# Altium schematic sheet 18 USB2_USB3.SchDoc: CM4 IO
size 297 x 209 mm; Page Create Date: March  8, 1995; Page Number: 18; Page Size: A4; Comment: radxa_1010; Page Count: 19; RevCode: V1.10; Doc: 18 USB2/USB3; DsnPath: D:\WMS\黄工\[RC126]CM4_IO_V1.10\[RC126]_V1.10\CM4 IO_V1.10.DSN; SchematicName: CM4 IO V1.10; PageName: 18 USB2/USB3; PageSize: A4; TopSchematic: True
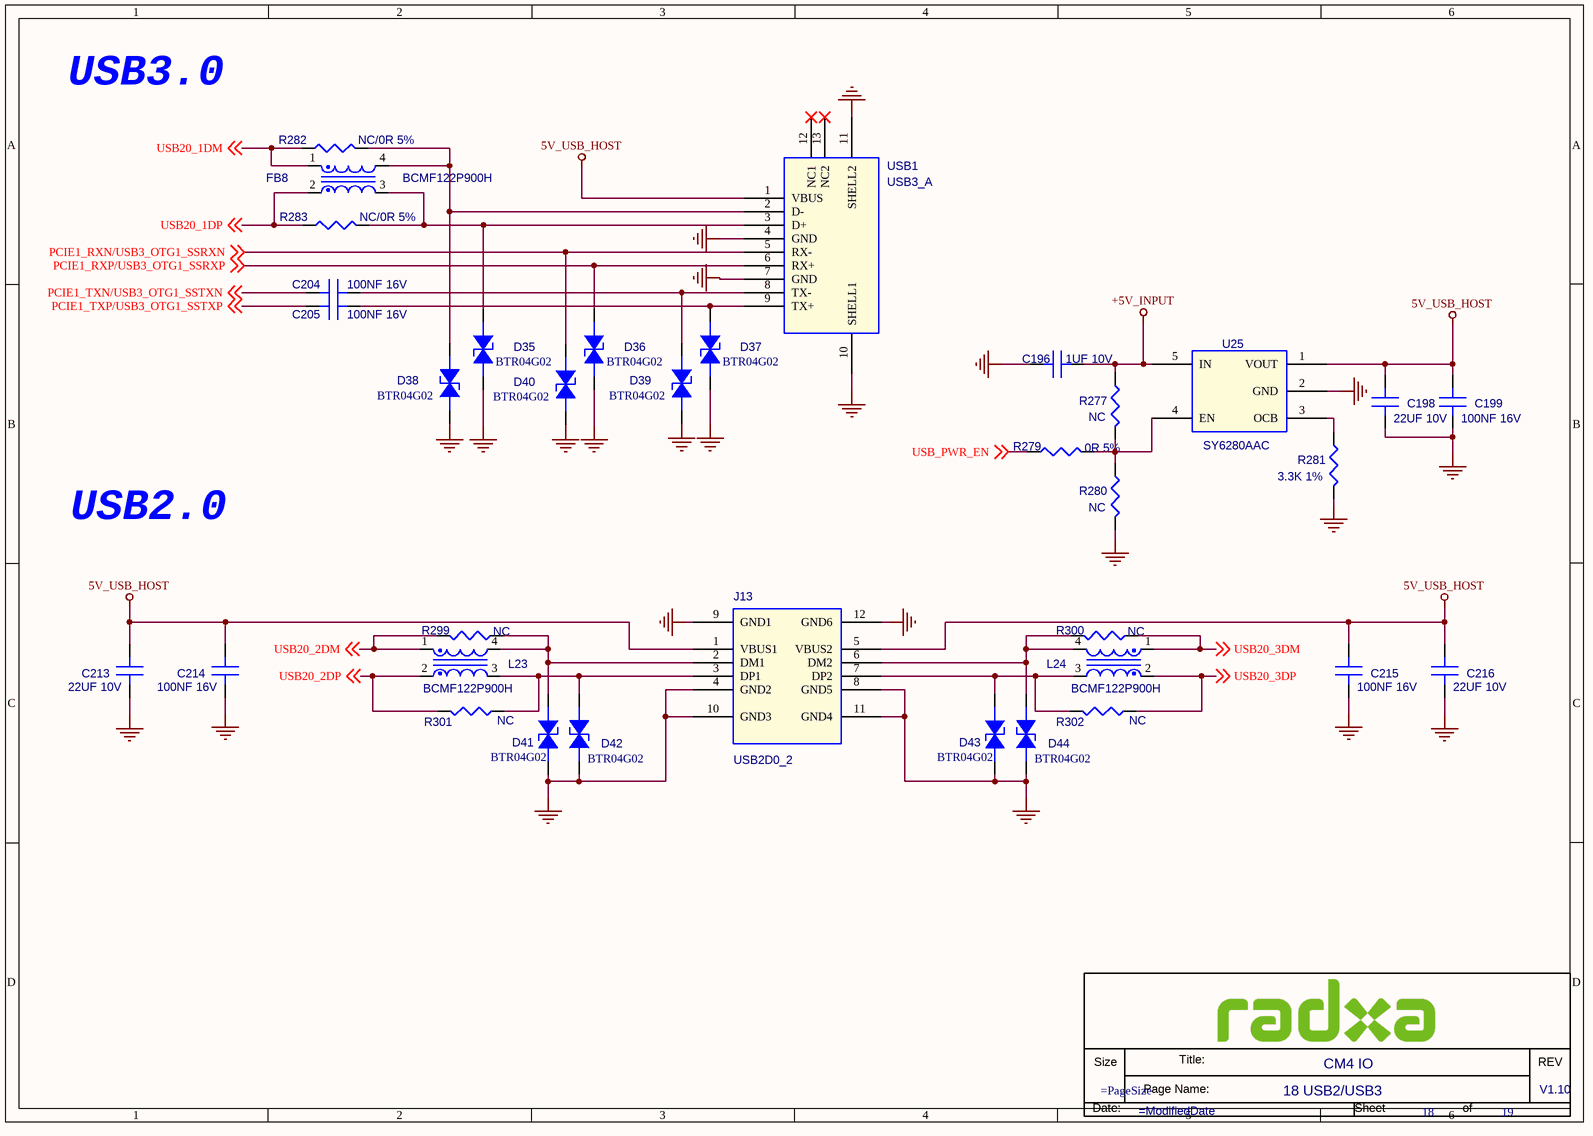
[diagram p0: 18 USB2_USB3.SchDoc]

## Parts
*  Doc: 18 USB2/USB3  RevCode: V1.10  Title: CM4 IO  Page Number: 18  Page Count: 19  (hidden comment: radxa_1010)  (graphical)
C196  1UF 10V  [C0201]
C198  22UF 10V  [C0603]
C199  100NF 16V  [C0201]
C204  100NF 16V  [C0201]
C205  100NF 16V  [C0201]
C213  22UF 10V  [C0603]
C214  100NF 16V  [C0201]
C215  100NF 16V  [C0201]
C216  22UF 10V  [C0603]
D35  BTR04G02  [DFN1006-2L]
D36  BTR04G02  [DFN1006-2L]
D37  BTR04G02  [DFN1006-2L]
D38  BTR04G02  [DFN1006-2L]
D39  BTR04G02  [DFN1006-2L]
D40  BTR04G02  [DFN1006-2L]
D41  BTR04G02  [DFN1006-2L]
D42  BTR04G02  [DFN1006-2L]
D43  BTR04G02  [DFN1006-2L]
D44  BTR04G02  [DFN1006-2L]
FB8  BCMF122P900H  [LC1210]
J13  USB2D0_2  [CON_USB2D0_TH1X2_LIE]
L23  BCMF122P900H  [LC1210]
L24  BCMF122P900H  [LC1210]
R277  NC  [R0402]
R279  0R 5%  [R0402]
R280  NC  [R0402]
R281  3.3K 1%  [R0402]
R282  NC/0R 5%  [R0402]
R283  NC/0R 5%  [R0402]
R299  NC  [R0402]
R300  NC  [R0402]
R301  NC  [R0402]
R302  NC  [R0402]
U25  SY6280AAC  [SOT23_5]
USB1  USB3_A  [USB_SM9_2D0_LIE]

## Nets
5V_USB_HOST: C198.1(A) C199.1(A) C213.1(A) C214.1(A) C215.1(A) C216.1(A) J13.1(VBUS1) J13.5(VBUS2) U25.1(VOUT) USB1.1(VBUS)
+5V_INPUT: C196.1(A) R277.1 U25.5(IN)
GND: C196.2(B) C198.2(B) C199.2(B) C213.2(B) C214.2(B) C215.2(B) C216.2(B) D35.1(ANODE) D36.1(ANODE) D37.1(ANODE) D38.1(ANODE) D39.1(ANODE) D40.1(ANODE) D41.1(ANODE) D42.1(ANODE) D43.1(ANODE) D44.1(ANODE) J13.4(GND2) J13.8(GND5) J13.9(GND1) J13.10(GND3) J13.11(GND4) J13.12(GND6) R280.2 R281.2 U25.2(GND) USB1.4(GND) USB1.7(GND) USB1.10(SHELL1) USB1.11(SHELL2)
PCIE1_RXN/USB3_OTG1_SSRXN: D40.2(CATHODE) USB1.5(RX-) ; off-sheet PCIE1_RXN/USB3_OTG1_SSRXN
PCIE1_RXP/USB3_OTG1_SSRXP: D36.2(CATHODE) USB1.6(RX+) ; off-sheet PCIE1_RXP/USB3_OTG1_SSRXP
PCIE1_TXN/USB3_OTG1_SSTXN: C204.1(A) ; off-sheet PCIE1_TXN/USB3_OTG1_SSTXN
PCIE1_TXP/USB3_OTG1_SSTXP: C205.1(A) ; off-sheet PCIE1_TXP/USB3_OTG1_SSTXP
USB20_1DM: FB8.1 R282.2 ; off-sheet USB20_1DM
USB20_1DP: FB8.2 R283.2 ; off-sheet USB20_1DP
USB20_2DM: L23.1 R299.1 ; off-sheet USB20_2DM
USB20_2DP: L23.2 R301.1 ; off-sheet USB20_2DP
USB20_3DM: L24.1 R300.1 ; off-sheet USB20_3DM
USB20_3DP: L24.2 R302.1 ; off-sheet USB20_3DP
USB_PWR_EN: R279.2 ; off-sheet USB_PWR_EN
NetC204_2: C204.2(B) D39.2(CATHODE) USB1.8(TX-)
NetC205_2: C205.2(B) D37.2(CATHODE) USB1.9(TX+)
NetD35_2: D35.2(CATHODE) FB8.3 R283.1 USB1.3(D+)
NetD38_2: D38.2(CATHODE) FB8.4 R282.1 USB1.2(D-)
NetD41_2: D41.2(CATHODE) J13.2(DM1) L23.4 R299.2
NetD42_2: D42.2(CATHODE) J13.3(DP1) L23.3 R301.2
NetD43_2: D43.2(CATHODE) J13.7(DP2) L24.3 R302.2
NetD44_2: D44.2(CATHODE) J13.6(DM2) L24.4 R300.2
NetR277_2: R277.2 R279.1 R280.1 U25.4(EN)
NetR281_1: R281.1 U25.3(OCB)

Not connected (* = marked no-connect by the designer): USB1 12(NC1)* 13(NC2)*

## Notes on the sheet
- USB3.0
- USB2.0
- (in symbol radxa_1010) Size; Title:; REV; Page Name:; Date:; Sheet; of

## Library data of the parts
C196 = C: SMD  0201  1UF  10V  X5R  ±20%  ROHS; PARTS: 1; Part Reference: C196; Part Number: A1C01.00081; OriginalSymbolOrigin: (0,30); PKG_TYPE: CAP2-100-250; LEVEL: STD; PINSWAP: (A,B); Value: 1UF 10V; Part Type: 陶瓷电容; PCB Footprint: C0201
C198 = C: SMD  0603  22UF  10V  X5R  ±20%  ROHS; PARTS: 1; Part Reference: C198; Part Number: A1C01.00015; OriginalSymbolOrigin: (0,30); PKG_TYPE: CAP2-100-250; LEVEL: STD; PINSWAP: (A,B); Value: 22UF 10V; Part Type: 陶瓷电容; PCB Footprint: C0603
C199 = C: SMD  0201  100NF  16V  X5R  ±20%  ROHS; PARTS: 1; Part Reference: C199; Part Number: A1C01.00099; OriginalSymbolOrigin: (0,30); PKG_TYPE: CAP2-100-250; LEVEL: STD; PINSWAP: (A,B); Preferred: 6715f349cd0bc5; Value: 100NF 16V; Part Type: 陶瓷电容
C204 = C: SMD  0201  100NF  16V  X5R  ±20%  ROHS; PARTS: 1; Part Reference: C204; Part Number: A1C01.00099; OriginalSymbolOrigin: (0,30); PKG_TYPE: CAP2-100-250; LEVEL: STD; PINSWAP: (A,B); Preferred: 6715f349cd0bc5; Value: 100NF 16V; Part Type: 陶瓷电容
C205 = C: SMD  0201  100NF  16V  X5R  ±20%  ROHS; PARTS: 1; Part Reference: C205; Part Number: A1C01.00099; OriginalSymbolOrigin: (0,30); PKG_TYPE: CAP2-100-250; LEVEL: STD; PINSWAP: (A,B); Preferred: 6715f349cd0bc5; Value: 100NF 16V; Part Type: 陶瓷电容
C213 = C: SMD  0603  22UF  10V  X5R  ±20%  ROHS; PARTS: 1; Part Reference: C213; Part Number: A1C01.00015; OriginalSymbolOrigin: (0,30); PKG_TYPE: CAP2-100-250; LEVEL: STD; PINSWAP: (A,B); Value: 22UF 10V; Part Type: 陶瓷电容; PCB Footprint: C0603
C214 = C: SMD  0201  100NF  16V  X5R  ±20%  ROHS; PARTS: 1; Part Reference: C214; Part Number: A1C01.00099; OriginalSymbolOrigin: (0,30); PKG_TYPE: CAP2-100-250; LEVEL: STD; PINSWAP: (A,B); Preferred: 6715f349cd0bc5; Value: 100NF 16V; Part Type: 陶瓷电容
C215 = C: SMD  0201  100NF  16V  X5R  ±20%  ROHS; PARTS: 1; Part Reference: C215; Part Number: A1C01.00099; OriginalSymbolOrigin: (0,30); PKG_TYPE: CAP2-100-250; LEVEL: STD; PINSWAP: (A,B); Preferred: 6715f349cd0bc5; Value: 100NF 16V; Part Type: 陶瓷电容
C216 = C: SMD  0603  22UF  10V  X5R  ±20%  ROHS; PARTS: 1; Part Reference: C216; Part Number: A1C01.00015; OriginalSymbolOrigin: (0,30); PKG_TYPE: CAP2-100-250; LEVEL: STD; PINSWAP: (A,B); Value: 22UF 10V; Part Type: 陶瓷电容; PCB Footprint: C0603
D35 = ESD: SMD  编带  0402  BTR04G02  B-tron  ROHS; Part Reference: D35; Part Number: A1D02.00002; Parameter: ESD-台舟 ESD5341N-封装 esd0402; ID: DE-E0004; Temp Coeff: -50℃ ~ +125℃; PCB Footprint: ESD_D0402; Value: BTR04G02; Part Type: 二极管-ESD管-桥堆-TVS管
D36 = ESD: SMD  编带  0402  BTR04G02  B-tron  ROHS; Part Reference: D36; Part Number: A1D02.00002; Parameter: ESD-台舟 ESD5341N-封装 esd0402; ID: DE-E0004; Temp Coeff: -50℃ ~ +125℃; PCB Footprint: ESD_D0402; Value: BTR04G02; Part Type: 二极管-ESD管-桥堆-TVS管
D37 = ESD: SMD  编带  0402  BTR04G02  B-tron  ROHS; Part Reference: D37; Part Number: A1D02.00002; Parameter: ESD-台舟 ESD5341N-封装 esd0402; ID: DE-E0004; Temp Coeff: -50℃ ~ +125℃; PCB Footprint: ESD_D0402; Value: BTR04G02; Part Type: 二极管-ESD管-桥堆-TVS管
D38 = ESD: SMD  编带  0402  BTR04G02  B-tron  ROHS; Part Reference: D38; Part Number: A1D02.00002; Parameter: ESD-台舟 ESD5341N-封装 esd0402; ID: DE-E0004; Temp Coeff: -50℃ ~ +125℃; PCB Footprint: ESD_D0402; Value: BTR04G02; Part Type: 二极管-ESD管-桥堆-TVS管
D39 = ESD: SMD  编带  0402  BTR04G02  B-tron  ROHS; Part Reference: D39; Part Number: A1D02.00002; Parameter: ESD-台舟 ESD5341N-封装 esd0402; ID: DE-E0004; Temp Coeff: -50℃ ~ +125℃; PCB Footprint: ESD_D0402; Value: BTR04G02; Part Type: 二极管-ESD管-桥堆-TVS管
D40 = ESD: SMD  编带  0402  BTR04G02  B-tron  ROHS; Part Reference: D40; Part Number: A1D02.00002; Parameter: ESD-台舟 ESD5341N-封装 esd0402; ID: DE-E0004; Temp Coeff: -50℃ ~ +125℃; PCB Footprint: ESD_D0402; Value: BTR04G02; Part Type: 二极管-ESD管-桥堆-TVS管
D41 = ESD: SMD  编带  0402  BTR04G02  B-tron  ROHS; Part Reference: D41; Part Number: A1D02.00002; Parameter: ESD-台舟 ESD5341N-封装 esd0402; ID: DE-E0004; Temp Coeff: -50℃ ~ +125℃; PCB Footprint: ESD_D0402; Value: BTR04G02; Part Type: 二极管-ESD管-桥堆-TVS管
D42 = ESD: SMD  编带  0402  BTR04G02  B-tron  ROHS; Part Reference: D42; Part Number: A1D02.00002; Parameter: ESD-台舟 ESD5341N-封装 esd0402; ID: DE-E0004; Temp Coeff: -50℃ ~ +125℃; PCB Footprint: ESD_D0402; Value: BTR04G02; Part Type: 二极管-ESD管-桥堆-TVS管
D43 = ESD: SMD  编带  0402  BTR04G02  B-tron  ROHS; Part Reference: D43; Part Number: A1D02.00002; Parameter: ESD-台舟 ESD5341N-封装 esd0402; ID: DE-E0004; Temp Coeff: -50℃ ~ +125℃; PCB Footprint: ESD_D0402; Value: BTR04G02; Part Type: 二极管-ESD管-桥堆-TVS管
D44 = ESD: SMD  编带  0402  BTR04G02  B-tron  ROHS; Part Reference: D44; Part Number: A1D02.00002; Parameter: ESD-台舟 ESD5341N-封装 esd0402; ID: DE-E0004; Temp Coeff: -50℃ ~ +125℃; PCB Footprint: ESD_D0402; Value: BTR04G02; Part Type: 二极管-ESD管-桥堆-TVS管
FB8 = MCZ1210AH900L2: SMD  BCMF122P900H  90R  4PIN  不带ESD  ±5%  B-tron  ROHS; Part Reference: FB8; Part Number: A1L03.00003; PCB Footprint: CML_SM4_0D6_1D5; Value: BCMF122P900H; Part Type: 共模电感
J13 = USB2D0_2: DIP  USB2.0母座  双层  卷边无定位柱  黑色胶芯  17.5*14.4*H15.6mm  90度弯脚  弯脚固定间距15.6mm  铜壳  BUSF082B1N12438  兴联  耐高温  ROHS; Part Reference: J13; Part Number: A1J08.00050; Preferred: 6715f349cd0bc5; Temp Coeff: -25℃ to +105℃; Value: USB2D0_2; Part Type: USB座; PCB Footprint: CON_USB2D0_TH1X2_LIE
L23 = MCZ1210AH900L2: SMD  BCMF122P900H  90R  4PIN  不带ESD  ±5%  B-tron  ROHS; Part Reference: L23; Part Number: A1L03.00003; PCB Footprint: CML_SM4_0D6_1D5; Value: BCMF122P900H; Part Type: 共模电感
L24 = MCZ1210AH900L2: SMD  BCMF122P900H  90R  4PIN  不带ESD  ±5%  B-tron  ROHS; Part Reference: L24; Part Number: A1L03.00003; PCB Footprint: CML_SM4_0D6_1D5; Value: BCMF122P900H; Part Type: 共模电感
R277 = R: SMD  0201  6.8K  1/20W  ±1%  ROHS; Part Reference: R277; Part Number: A1R01.00158; PCB Footprint: R0201; Value: NC; Part Type: 贴片电阻
R279 = R: SMD  0201  1K  1/20W  ±5%  ROHS; Part Reference: R279; Part Number: A1R01.00018; PCB Footprint: R0201; Value: 0R 5%; Part Type: 贴片电阻
R280 = R: SMD  0201  6.8K  1/20W  ±1%  ROHS; Part Reference: R280; Part Number: A1R01.00158; PCB Footprint: R0201; Value: NC; Part Type: 贴片电阻
R281 = R: SMD  0201  3.3K  1/20W  ±1%  ROHS; Part Reference: R281; Part Number: A1R01.00178; PCB Footprint: R0201; Value: 3.3K 1%; Part Type: 贴片电阻
R282 = R: SMD  0201  0R  1/20W  ±5%  ROHS; Part Reference: R282; Part Number: A1R01.00027; PCB Footprint: R0201; Temp Coeff: －55℃ ~ ＋125℃; Value: NC/0R 5%; Part Type: 贴片电阻
R283 = R: SMD  0201  0R  1/20W  ±5%  ROHS; Part Reference: R283; Part Number: A1R01.00027; PCB Footprint: R0201; Temp Coeff: －55℃ ~ ＋125℃; Value: NC/0R 5%; Part Type: 贴片电阻
R299 = R: SMD  0201  0R  1/20W  ±5%  ROHS; Part Reference: R299; Part Number: A1R01.00027; PCB Footprint: R0201; Temp Coeff: －55℃ ~ ＋125℃; Value: NC; Part Type: 贴片电阻
R300 = R: SMD  0201  0R  1/20W  ±5%  ROHS; Part Reference: R300; Part Number: A1R01.00027; PCB Footprint: R0201; Temp Coeff: －55℃ ~ ＋125℃; Value: NC; Part Type: 贴片电阻
R301 = R: SMD  0201  0R  1/20W  ±5%  ROHS; Part Reference: R301; Part Number: A1R01.00027; PCB Footprint: R0201; Temp Coeff: －55℃ ~ ＋125℃; Value: NC; Part Type: 贴片电阻
R302 = R: SMD  0201  0R  1/20W  ±5%  ROHS; Part Reference: R302; Part Number: A1R01.00027; PCB Footprint: R0201; Temp Coeff: －55℃ ~ ＋125℃; Value: NC; Part Type: 贴片电阻
U25 = SY6280: SMD  USB限流  SY6280AAC  SOT23-5  silergy(矽力杰)  ROHS; Part Reference: U25; Part Number: A1I01.00017; PCB Footprint: SOT23_5; Value: SY6280AAC; Part Type: 集成电路/模块
USB1 = USB3_A: SMD  USB3.0母座  单层  直边无定位柱  蓝色胶芯  14.5*13*H6.8mm  90度弯脚  直脚固定间距12.6mm  5001-01010011A  文章济美  鱼叉脚  脚长2.7mm  ROHS; Part Reference: USB1; Part Number: A1J08.00010; PCB Footprint: USB_SM9_2D0_LIE; Value: USB3_A; Part Type: USB座
* = radxa_1010: Page Create Date: March  8, 1995; Page Size: =PageSize; Page Modify Date: =ModifiedDate